# EasyEDA Pro project SoPi.epro, schematic Schematic2
Board Name: Board2; Create Date: 2026-05-02; Page Name: P1; Project Name: My_F1C200S; Schematic Name: Schematic2; Update Date: 2026-05-02; Add into BOM: yes; Company: 嘉立创EDA; Convert to PCB: yes; Page Size: A4; Version: V1.0
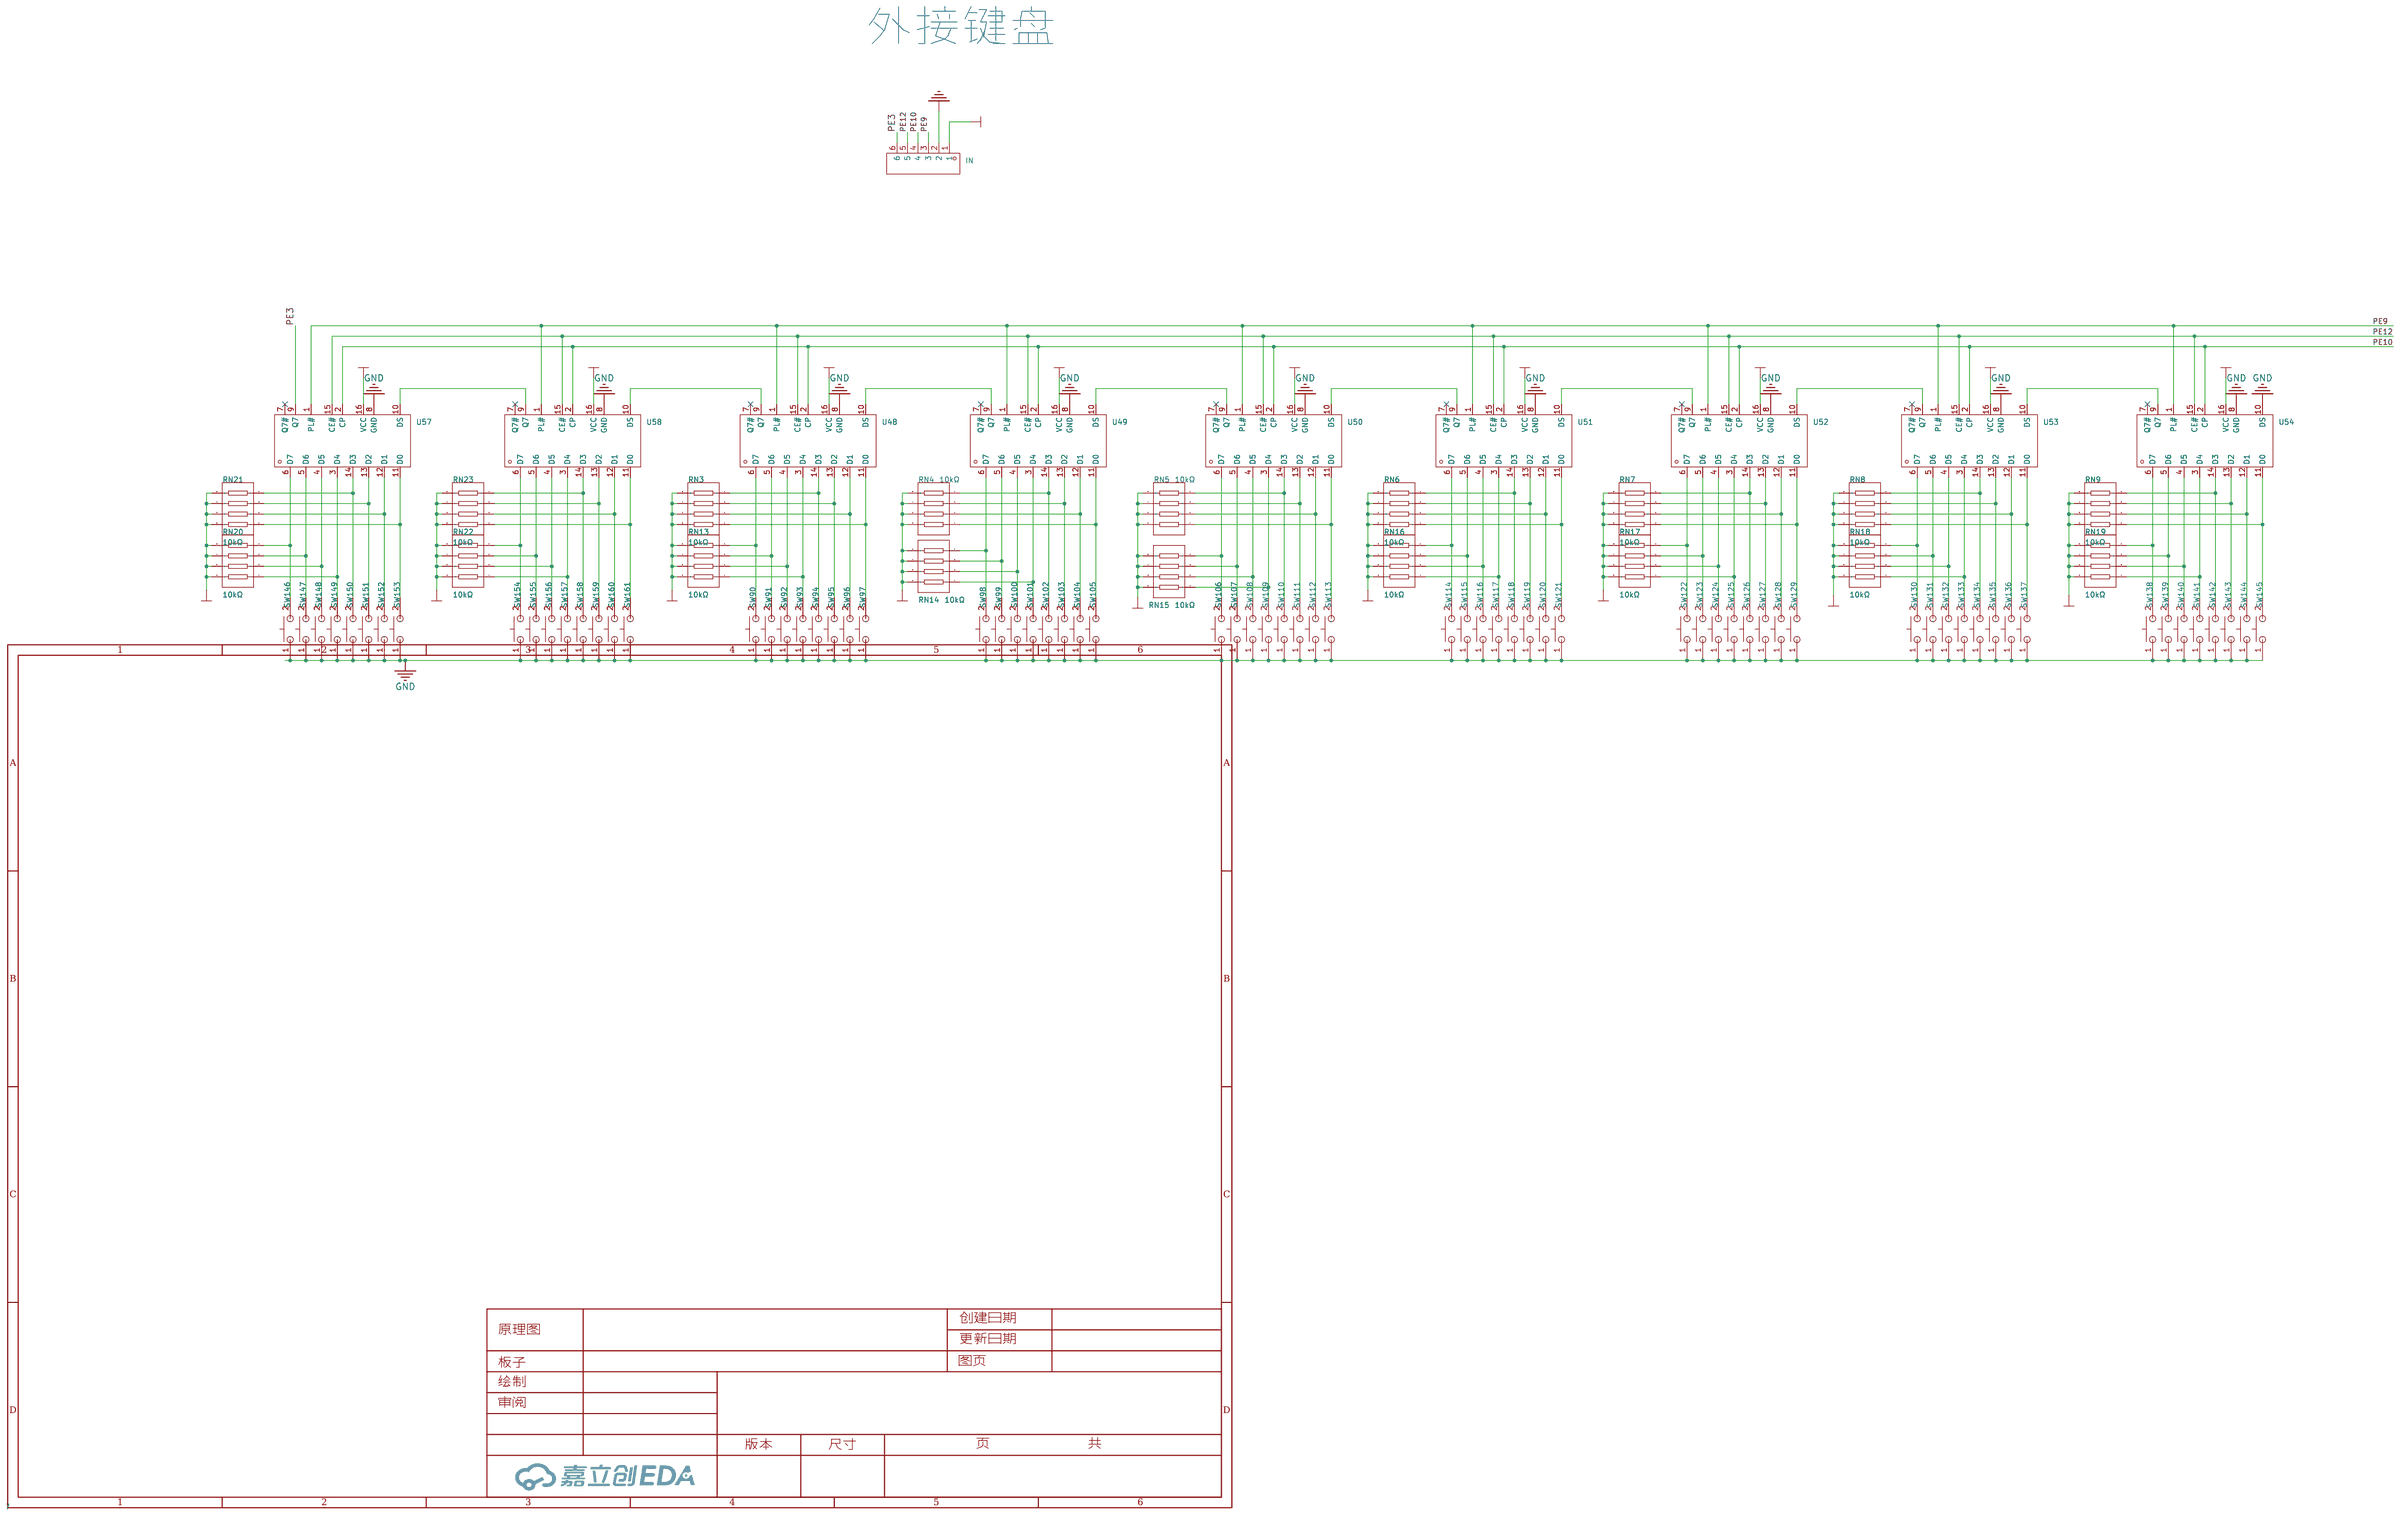
[diagram p1: schematic sheet]

## Parts
IN  -  [HDR-TH_6P-P2.54-V-F]
RN3  10kΩ  [RES-ARRAY-SMD_0603-8P-L3.2-W1.6-BL]
RN4  10kΩ  [RES-ARRAY-SMD_0603-8P-L3.2-W1.6-BL]
RN5  10kΩ  [RES-ARRAY-SMD_0603-8P-L3.2-W1.6-BL]
RN6  10kΩ  [RES-ARRAY-SMD_0603-8P-L3.2-W1.6-BL]
RN7  10kΩ  [RES-ARRAY-SMD_0603-8P-L3.2-W1.6-BL]
RN8  10kΩ  [RES-ARRAY-SMD_0603-8P-L3.2-W1.6-BL]
RN9  10kΩ  [RES-ARRAY-SMD_0603-8P-L3.2-W1.6-BL]
RN13  10kΩ  [RES-ARRAY-SMD_0603-8P-L3.2-W1.6-BL]
RN14  10kΩ  [RES-ARRAY-SMD_0603-8P-L3.2-W1.6-BL]
RN15  10kΩ  [RES-ARRAY-SMD_0603-8P-L3.2-W1.6-BL]
RN16  10kΩ  [RES-ARRAY-SMD_0603-8P-L3.2-W1.6-BL]
RN17  10kΩ  [RES-ARRAY-SMD_0603-8P-L3.2-W1.6-BL]
RN18  10kΩ  [RES-ARRAY-SMD_0603-8P-L3.2-W1.6-BL]
RN19  10kΩ  [RES-ARRAY-SMD_0603-8P-L3.2-W1.6-BL]
RN20  10kΩ  [RES-ARRAY-SMD_0603-8P-L3.2-W1.6-BL]
RN21  10kΩ  [RES-ARRAY-SMD_0603-8P-L3.2-W1.6-BL]
RN22  10kΩ  [RES-ARRAY-SMD_0603-8P-L3.2-W1.6-BL]
RN23  10kΩ  [RES-ARRAY-SMD_0603-8P-L3.2-W1.6-BL]
SW90  -  [SW-SMD_L3.9-W2.9-P4.15-LS5.0]
SW91  -  [SW-SMD_L3.9-W2.9-P4.15-LS5.0]
SW92  -  [SW-SMD_L3.9-W2.9-P4.15-LS5.0]
SW93  -  [SW-SMD_L3.9-W2.9-P4.15-LS5.0]
SW94  -  [SW-SMD_L3.9-W2.9-P4.15-LS5.0]
SW95  -  [SW-SMD_L3.9-W2.9-P4.15-LS5.0]
SW96  -  [SW-SMD_L3.9-W2.9-P4.15-LS5.0]
SW97  -  [SW-SMD_L3.9-W2.9-P4.15-LS5.0]
SW98  -  [SW-SMD_L3.9-W2.9-P4.15-LS5.0]
SW99  -  [SW-SMD_L3.9-W2.9-P4.15-LS5.0]
SW100  -  [SW-SMD_L3.9-W2.9-P4.15-LS5.0]
SW101  -  [SW-SMD_L3.9-W2.9-P4.15-LS5.0]
SW102  -  [SW-SMD_L3.9-W2.9-P4.15-LS5.0]
SW103  -  [SW-SMD_L3.9-W2.9-P4.15-LS5.0]
SW104  -  [SW-SMD_L3.9-W2.9-P4.15-LS5.0]
SW105  -  [SW-SMD_L3.9-W2.9-P4.15-LS5.0]
SW106  -  [SW-SMD_L3.9-W2.9-P4.15-LS5.0]
SW107  -  [SW-SMD_L3.9-W2.9-P4.15-LS5.0]
SW108  -  [SW-SMD_L3.9-W2.9-P4.15-LS5.0]
SW109  -  [SW-SMD_L3.9-W2.9-P4.15-LS5.0]
SW110  -  [SW-SMD_L3.9-W2.9-P4.15-LS5.0]
SW111  -  [SW-SMD_L3.9-W2.9-P4.15-LS5.0]
SW112  -  [SW-SMD_L3.9-W2.9-P4.15-LS5.0]
SW113  -  [SW-SMD_L3.9-W2.9-P4.15-LS5.0]
SW114  -  [SW-SMD_L3.9-W2.9-P4.15-LS5.0]
SW115  -  [SW-SMD_L3.9-W2.9-P4.15-LS5.0]
SW116  -  [SW-SMD_L3.9-W2.9-P4.15-LS5.0]
SW117  -  [SW-SMD_L3.9-W2.9-P4.15-LS5.0]
SW118  -  [SW-SMD_L3.9-W2.9-P4.15-LS5.0]
SW119  -  [SW-SMD_L3.9-W2.9-P4.15-LS5.0]
SW120  -  [SW-SMD_L3.9-W2.9-P4.15-LS5.0]
SW121  -  [SW-SMD_L3.9-W2.9-P4.15-LS5.0]
SW122  -  [SW-SMD_L3.9-W2.9-P4.15-LS5.0]
SW123  -  [SW-SMD_L3.9-W2.9-P4.15-LS5.0]
SW124  -  [SW-SMD_L3.9-W2.9-P4.15-LS5.0]
SW125  -  [SW-SMD_L3.9-W2.9-P4.15-LS5.0]
SW126  -  [SW-SMD_L3.9-W2.9-P4.15-LS5.0]
SW127  -  [SW-SMD_L3.9-W2.9-P4.15-LS5.0]
SW128  -  [SW-SMD_L3.9-W2.9-P4.15-LS5.0]
SW129  -  [SW-SMD_L3.9-W2.9-P4.15-LS5.0]
SW130  -  [SW-SMD_L3.9-W2.9-P4.15-LS5.0]
SW131  -  [SW-SMD_L3.9-W2.9-P4.15-LS5.0]
SW132  -  [SW-SMD_L3.9-W2.9-P4.15-LS5.0]
SW133  -  [SW-SMD_L3.9-W2.9-P4.15-LS5.0]
SW134  -  [SW-SMD_L3.9-W2.9-P4.15-LS5.0]
SW135  -  [SW-SMD_L3.9-W2.9-P4.15-LS5.0]
SW136  -  [SW-SMD_L3.9-W2.9-P4.15-LS5.0]
SW137  -  [SW-SMD_L3.9-W2.9-P4.15-LS5.0]
SW138  -  [SW-SMD_L3.9-W2.9-P4.15-LS5.0]
SW139  -  [SW-SMD_L3.9-W2.9-P4.15-LS5.0]
SW140  -  [SW-SMD_L3.9-W2.9-P4.15-LS5.0]
SW141  -  [SW-SMD_L3.9-W2.9-P4.15-LS5.0]
SW142  -  [SW-SMD_L3.9-W2.9-P4.15-LS5.0]
SW143  -  [SW-SMD_L3.9-W2.9-P4.15-LS5.0]
SW144  -  [SW-SMD_L3.9-W2.9-P4.15-LS5.0]
SW145  -  [SW-SMD_L3.9-W2.9-P4.15-LS5.0]
SW146  -  [SW-SMD_L3.9-W2.9-P4.15-LS5.0]
SW147  -  [SW-SMD_L3.9-W2.9-P4.15-LS5.0]
SW148  -  [SW-SMD_L3.9-W2.9-P4.15-LS5.0]
SW149  -  [SW-SMD_L3.9-W2.9-P4.15-LS5.0]
SW150  -  [SW-SMD_L3.9-W2.9-P4.15-LS5.0]
SW151  -  [SW-SMD_L3.9-W2.9-P4.15-LS5.0]
SW152  -  [SW-SMD_L3.9-W2.9-P4.15-LS5.0]
SW153  -  [SW-SMD_L3.9-W2.9-P4.15-LS5.0]
SW154  -  [SW-SMD_L3.9-W2.9-P4.15-LS5.0]
SW155  -  [SW-SMD_L3.9-W2.9-P4.15-LS5.0]
SW156  -  [SW-SMD_L3.9-W2.9-P4.15-LS5.0]
SW157  -  [SW-SMD_L3.9-W2.9-P4.15-LS5.0]
SW158  -  [SW-SMD_L3.9-W2.9-P4.15-LS5.0]
SW159  -  [SW-SMD_L3.9-W2.9-P4.15-LS5.0]
SW160  -  [SW-SMD_L3.9-W2.9-P4.15-LS5.0]
SW161  -  [SW-SMD_L3.9-W2.9-P4.15-LS5.0]
U48  -  [SOIC-16_L9.9-W3.9-P1.27-LS6.0-BL]
U49  -  [SOIC-16_L9.9-W3.9-P1.27-LS6.0-BL]
U50  -  [SOIC-16_L9.9-W3.9-P1.27-LS6.0-BL]
U51  -  [SOIC-16_L9.9-W3.9-P1.27-LS6.0-BL]
U52  -  [SOIC-16_L9.9-W3.9-P1.27-LS6.0-BL]
U53  -  [SOIC-16_L9.9-W3.9-P1.27-LS6.0-BL]
U54  -  [SOIC-16_L9.9-W3.9-P1.27-LS6.0-BL]
U57  -  [SOIC-16_L9.9-W3.9-P1.27-LS6.0-BL]
U58  -  [SOIC-16_L9.9-W3.9-P1.27-LS6.0-BL]

## Library data of the parts
IN = HDR-F_2.54_1x6P: Supplier Part: C40877; Supplier Footprint: 插件
RN3-RN9 RN13-RN23 = 4D03WGJ0103T5E: 阻值:10kΩ;精度:±5%;单个元件功率:62.5mW;温度系数:±200ppm/;电阻器数:4;引脚数:8;; LCSC Part Name: 10kΩ ±5%; Supplier Part: C29718; Manufacturer: UNI-ROYAL(厚声); Supplier Footprint: 0603x4; Datasheet: https://atta.szlcsc.com/upload/public/pdf/source/20170615/1497511005633.pdf; Supplier: LCSC; Tolerance: ±5%; Power(Watts): 62.5mW; Temperature Coefficient: ±200ppm/; Number of Resistors: 4; Number of Pins: 8
SW90-SW161 = GT-TC029B-H025-L1N: 触点电流:50mA;额定电压(DC):12V;绝缘电阻:100MΩ;电路结构:单刀单掷;安装方式:立贴;按钮形状:圆形按钮;按钮/盖帽颜色:黑色;带灯:无;作用力:250gf@±30gf;机械寿命:100000;工作温度:-30℃~+85℃;引脚样式:SMD接片;开关长度:3.9mm;开关宽度:2.9mm;开关高度:2.5mm;带支架:否;; LCSC Part Name: 立式两脚小龟H2.5 250gf 无柱; Supplier Part: C843669; Manufacturer: G-Switch(品赞); Supplier Footprint: SMD,3×4×2.5mm; JLCPCB Part Class: Extended Part; Datasheet: https://atta.szlcsc.com/upload/public/pdf/source/20201014/C843665_B07D254A2E90B746498E934B945CCD5F.pdf; Supplier: LCSC; Contact Current: 50mA; Voltage Rating (DC): 12V; Insulation Resistance: 100MΩ; Circuit: 单刀单掷; Mounting Style: 立贴; Actuator Style: 圆形按钮; Actuator/Cap Color: 黑色; With Lamp: 无; Operating Force: 250gf@±30gf; Mechanical Life: 100000; Operating Temperature: -30℃~+85℃; Pin Style: SMD接片; Switch Length: 3.9mm; Switch Width: 2.9mm; Switch Height: 2.5mm; Strike Gundam: 否
U48-U54 U57 U58 = 74HC165D,653: Supplier Part: C5613; Manufacturer: Nexperia(安世); Supplier Footprint: SOIC-16_150mil; Datasheet: https://atta.szlcsc.com/upload/public/pdf/source/20160218/1457707760975.pdf; Supplier: LCSC

## Nets
+3V3: IN.1 RN3.5 RN3.6 RN3.7 RN3.8 RN4.5 RN4.6 RN4.7 RN4.8 RN5.5 RN5.6 RN5.7 RN5.8 RN6.5 RN6.6 RN6.7 RN6.8 RN7.5 RN7.6 RN7.7 RN7.8 RN8.5 RN8.6 RN8.7 RN8.8 RN9.5 RN9.6 RN9.7 RN9.8 RN13.5 RN13.6 RN13.7 RN13.8 RN14.5 RN14.6 RN14.7 RN14.8 RN15.5 RN15.6 RN15.7 RN15.8 RN16.5 RN16.6 RN16.7 RN16.8 RN17.5 RN17.6 RN17.7 RN17.8 RN18.5 RN18.6 RN18.7 RN18.8 RN19.5 RN19.6 RN19.7 RN19.8 RN20.5 RN20.6 RN20.7 RN20.8 RN21.5 RN21.6 RN21.7 RN21.8 RN22.5 RN22.6 RN22.7 RN22.8 RN23.5 RN23.6 RN23.7 RN23.8 U48.16(VCC) U49.16(VCC) U50.16(VCC) U51.16(VCC) U52.16(VCC) U53.16(VCC) U54.16(VCC) U57.16(VCC) U58.16(VCC)
GND: IN.2 SW90.1 SW91.1 SW92.1 SW93.1 SW94.1 SW95.1 SW96.1 SW97.1 SW98.1 SW99.1 SW100.1 SW101.1 SW102.1 SW103.1 SW104.1 SW105.1 SW106.1 SW107.1 SW108.1 SW109.1 SW110.1 SW111.1 SW112.1 SW113.1 SW114.1 SW115.1 SW116.1 SW117.1 SW118.1 SW119.1 SW120.1 SW121.1 SW122.1 SW123.1 SW124.1 SW125.1 SW126.1 SW127.1 SW128.1 SW129.1 SW130.1 SW131.1 SW132.1 SW133.1 SW134.1 SW135.1 SW136.1 SW137.1 SW138.1 SW139.1 SW140.1 SW141.1 SW142.1 SW143.1 SW144.1 SW145.1 SW146.1 SW147.1 SW148.1 SW149.1 SW150.1 SW151.1 SW152.1 SW153.1 SW154.1 SW155.1 SW156.1 SW157.1 SW158.1 SW159.1 SW160.1 SW161.1 U48.8(GND) U49.8(GND) U50.8(GND) U51.8(GND) U52.8(GND) U53.8(GND) U54.8(GND) U54.10(DS) U57.8(GND) U58.8(GND)
PE3: IN.6 U57.9(Q7)
PE9: IN.3 U48.1(PL#) U49.1(PL#) U50.1(PL#) U51.1(PL#) U52.1(PL#) U53.1(PL#) U54.1(PL#) U57.1(PL#) U58.1(PL#)
PE10: IN.4 U48.2(CP) U49.2(CP) U50.2(CP) U51.2(CP) U52.2(CP) U53.2(CP) U54.2(CP) U57.2(CP) U58.2(CP)
PE12: IN.5 U48.15(CE#) U49.15(CE#) U50.15(CE#) U51.15(CE#) U52.15(CE#) U53.15(CE#) U54.15(CE#) U57.15(CE#) U58.15(CE#)
$1N34101: RN15.1 SW106.2 U50.6(D7)
$1N34102: RN15.2 SW107.2 U50.5(D6)
$1N34103: RN15.3 SW108.2 U50.4(D5)
$1N34104: RN15.4 SW109.2 U50.3(D4)
$1N34105: RN5.4 SW113.2 U50.11(D0)
$1N34106: RN5.1 SW110.2 U50.14(D3)
$1N34107: RN5.2 SW111.2 U50.13(D2)
$1N34108: RN5.3 SW112.2 U50.12(D1)
$1N34113: RN18.1 SW130.2 U53.6(D7)
$1N34114: RN18.2 SW131.2 U53.5(D6)
$1N34115: RN18.3 SW132.2 U53.4(D5)
$1N34116: RN18.4 SW133.2 U53.3(D4)
$1N34117: RN8.4 SW137.2 U53.11(D0)
$1N34118: RN8.1 SW134.2 U53.14(D3)
$1N34119: RN8.2 SW135.2 U53.13(D2)
$1N34120: RN8.3 SW136.2 U53.12(D1)
$1N34124: RN19.1 SW138.2 U54.6(D7)
$1N34125: RN19.2 SW139.2 U54.5(D6)
$1N34126: RN19.3 SW140.2 U54.4(D5)
$1N34127: RN19.4 SW141.2 U54.3(D4)
$1N34128: RN9.1 SW142.2 U54.14(D3)
$1N34135: RN3.3 SW96.2 U48.12(D1)
$1N34136: RN3.2 SW95.2 U48.13(D2)
$1N34137: RN3.1 SW94.2 U48.14(D3)
$1N34138: RN3.4 SW97.2 U48.11(D0)
$1N34139: RN13.4 SW93.2 U48.3(D4)
$1N34140: RN13.3 SW92.2 U48.4(D5)
$1N34141: RN13.2 SW91.2 U48.5(D6)
$1N34142: RN13.1 SW90.2 U48.6(D7)
$1N34146: RN7.3 SW128.2 U52.12(D1)
$1N34147: RN7.2 SW127.2 U52.13(D2)
$1N34148: RN7.1 SW126.2 U52.14(D3)
$1N34149: RN7.4 SW129.2 U52.11(D0)
$1N34150: RN17.4 SW125.2 U52.3(D4)
$1N34151: RN17.3 SW124.2 U52.4(D5)
$1N34152: RN17.2 SW123.2 U52.5(D6)
$1N34153: RN17.1 SW122.2 U52.6(D7)
$1N34156: RN6.2 SW119.2 U51.13(D2)
$1N34157: RN6.4 SW121.2 U51.11(D0)
$1N34158: RN16.4 SW117.2 U51.3(D4)
$1N34159: RN16.2 SW115.2 U51.5(D6)
$1N34160: RN6.1 SW118.2 U51.14(D3)
$1N34161: RN6.3 SW120.2 U51.12(D1)
$1N34162: RN16.3 SW116.2 U51.4(D5)
$1N34163: RN16.1 SW114.2 U51.6(D7)
$1N34164: U48.9(Q7) U58.10(DS)
$1N34165: U48.10(DS) U49.9(Q7)
$1N34166: U49.10(DS) U50.9(Q7)
$1N34167: U50.10(DS) U51.9(Q7)
$1N34168: U51.10(DS) U52.9(Q7)
$1N34169: U52.10(DS) U53.9(Q7)
$1N34170: U53.10(DS) U54.9(Q7)
$1N34172: RN14.4 SW101.2 U49.3(D4)
$1N34173: RN14.3 SW100.2 U49.4(D5)
$1N34174: RN14.2 SW99.2 U49.5(D6)
$1N34175: RN14.1 SW98.2 U49.6(D7)
$1N34176: RN4.3 SW104.2 U49.12(D1)
$1N34177: RN4.2 SW103.2 U49.13(D2)
$1N34178: RN4.1 SW102.2 U49.14(D3)
$1N34179: RN4.4 SW105.2 U49.11(D0)
$1N34186: RN9.3 SW144.2 U54.12(D1)
$1N34187: RN9.2 SW143.2 U54.13(D2)
$1N34188: RN9.4 SW145.2 U54.11(D0)
$1N34206: RN21.3 SW152.2 U57.12(D1)
$1N34207: RN21.2 SW151.2 U57.13(D2)
$1N34208: RN21.1 SW150.2 U57.14(D3)
$1N34209: RN21.4 SW153.2 U57.11(D0)
$1N34210: RN20.4 SW149.2 U57.3(D4)
$1N34211: RN20.3 SW148.2 U57.4(D5)
$1N34212: RN20.2 SW147.2 U57.5(D6)
$1N34213: RN20.1 SW146.2 U57.6(D7)
$1N34214: U57.10(DS) U58.9(Q7)
$1N34216: RN22.4 SW157.2 U58.3(D4)
$1N34217: RN22.3 SW156.2 U58.4(D5)
$1N34218: RN22.2 SW155.2 U58.5(D6)
$1N34219: RN22.1 SW154.2 U58.6(D7)
$1N34220: RN23.3 SW160.2 U58.12(D1)
$1N34221: RN23.2 SW159.2 U58.13(D2)
$1N34222: RN23.1 SW158.2 U58.14(D3)
$1N34223: RN23.4 SW161.2 U58.11(D0)

Not connected (* = marked no-connect by the designer): U48 7(Q7#)*; U49 7(Q7#)*; U50 7(Q7#)*; U51 7(Q7#)*; U52 7(Q7#)*; U53 7(Q7#)*; U54 7(Q7#)*; U57 7(Q7#)*; U58 7(Q7#)*

## Notes on the sheet
- 外接键盘
